# EAGLE design 5V AC-DC Convertor (EAGLE 9.6.2)
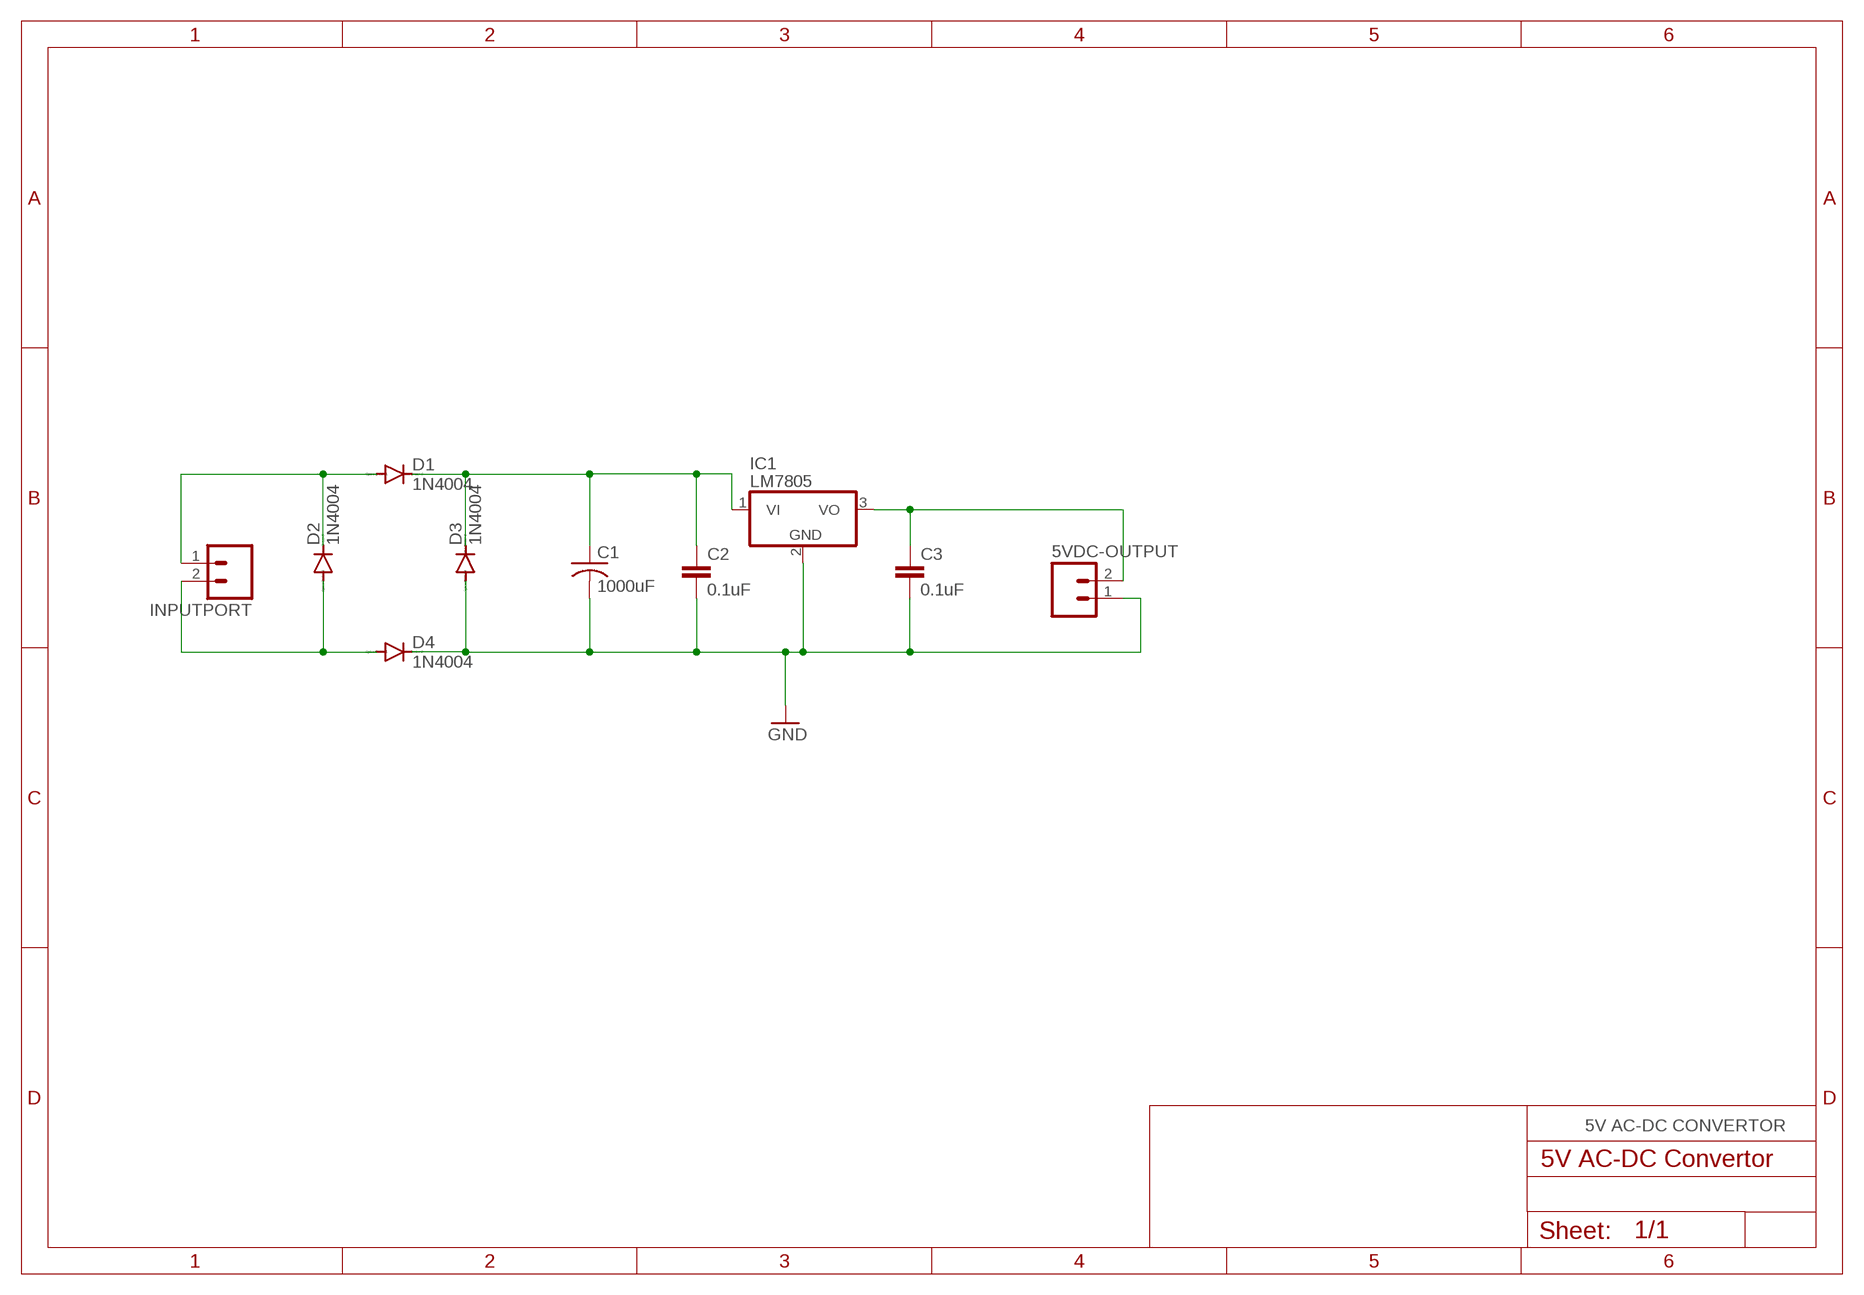
[diagram p0: schematic, sheet 1]

## Parts
5VDC-OUTPUT  M02  [02P]
C1  1000uF  C-US025-024X044  [C025-024X044]
C2  0.1uF  C-EU025-025X050  [C025-025X050]
C3  0.1uF  C-EU025-025X050  [C025-025X050]
D1  1N4004  [DO41-10]
D2  1N4004  [DO41-10]
D3  1N4004  [DO41-10]
D4  1N4004  [DO41-10]
IC1  LM7805  786TV  [TO220V]
INPUTPORT  M02  [02P]

## Nets
GND: 5VDC-OUTPUT.1 C1.2 C2.2 C3.2 D3.A D4.C IC1.2(GND)
N$1: D1.A D2.C INPUTPORT.1
N$2: D2.A D4.A INPUTPORT.2
N$3: C1.1 C2.1 D1.C D3.C IC1.1(VI)
N$8: 5VDC-OUTPUT.2 C3.1 IC1.3(VO)

## Notes on the sheet
- 5V AC-DC CONVERTOR

## Library data of the parts
5VDC-OUTPUT INPUTPORT = con-amp-quick:M02: AMP QUICK CONNECTOR; OC_FARNELL: unknown; OC_NEWARK: unknown
C1 = rcl:C-US: CAPACITOR, American symbol; SPICEPREFIX: C
C2 C3 = rcl:C-EU: CAPACITOR, European symbol; SPICEPREFIX: C
D1-D4 = diode:1N4004: DIODE general purpose rectifier, 1 A
IC1 = linear:78*: Positive VOLTAGE REGULATOR Source: http://cache.national.com/ds/LM/LM78L05.pdf http://www.fairchildsemi.com/ds/LM/LM7805.pdf

## Board
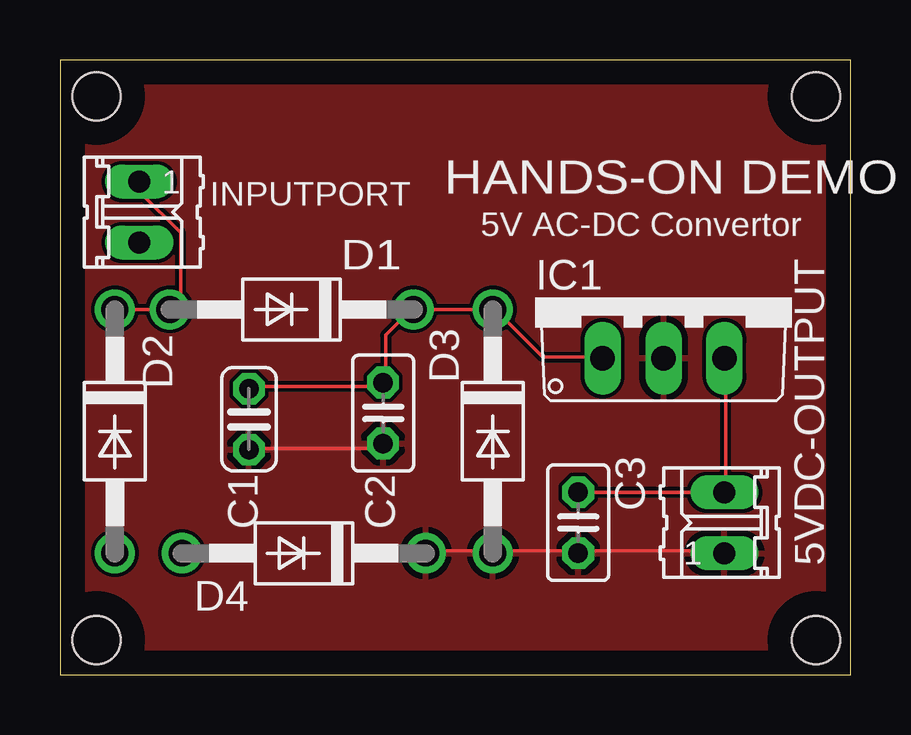
[diagram p1: board, top side]
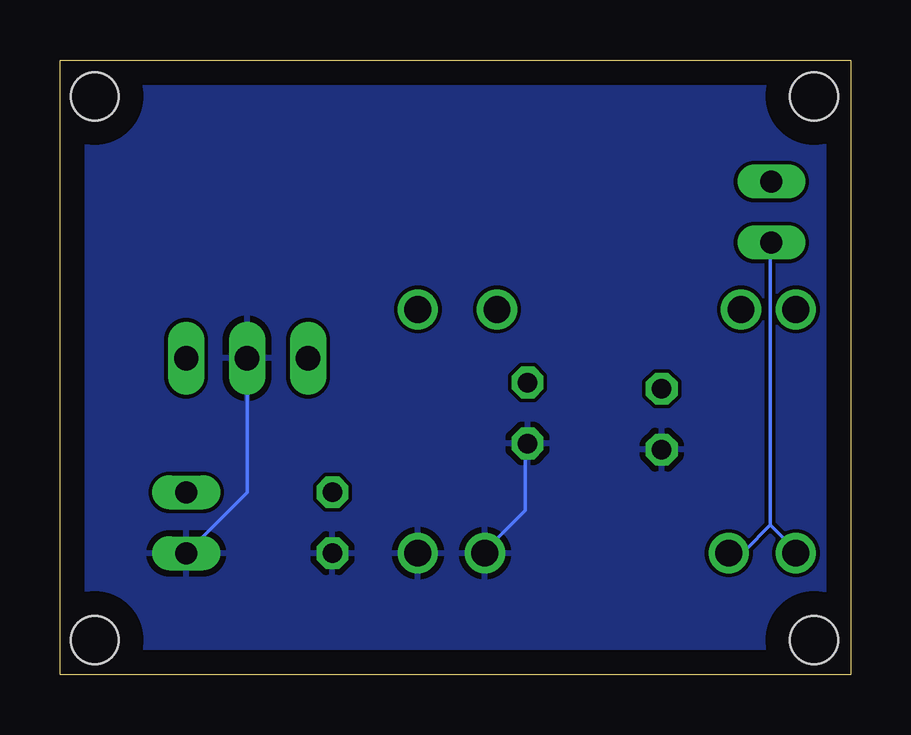
[diagram p2: board, bottom side, seen from below]

Size 32.94 x 25.64 mm. Coordinates in mm from the lower left corner, seen from the top.
Outline: 0,0 32.94,0 32.94,25.64 0,25.64 0,0
Copper layers (1*16): Top 0.035mm / dielectric 1.5mm / Bottom 0.035mm
Design rules "default": minimum track width 6mil, minimum drill 0.35mm, track to track 6mil, track to pad 6mil, pad to pad 6mil, via to via 6mil, smd to smd 6mil, copper to edge 40mil, drill to drill 6mil, minimum pad ring 10mil, minimum via ring 8mil, stop-mask expansion 4mil, vias tented up to drill 0mil, thermal gap 10mil
Holes 2 mm at 1.52,24.13 31.5,24.13 1.52,1.46 31.5,1.46

### Footprints (pad centres in the part's own frame; a part is rotated, then mirrored left to right if it is on the bottom)
02P = drill 0.914 long: 1 -1.27,0; 2 1.27,0
C025-024X044 = drill 0.813 octagon: 1 -1.27,0; 2 1.27,0
C025-025X050 = drill 0.813 octagon: 1 -1.27,0; 2 1.27,0
DO41-10 = drill 1.118: A 5.08,0; C -5.08,0
TO220V = drill 1.016 long: 1 -2.54,-2.54; 2 0,-2.54; 3 2.54,-2.54

### Placement (x,y rotation side)
5VDC-OUTPUT  27.69,6.35 90 top
C1  7.87,10.67 270 top
C2  13.46,10.92 270 top
C3  21.59,6.35 270 top
D1  9.65,15.24 180 top
D2  2.29,10.16 270 top
D3  18.03,10.16 270 top
D4  10.16,5.08 180 top
IC1  25.15,15.75 0 top
INPUTPORT  3.3,19.3 270 top

### Tracks (layer width: path | path; a pad name or v marks a point on that pad's centre or on a via)
GND
  Top 0.152: C2.2 13.26,9.45 7.92,9.45 C1.2 | 5VDC-OUTPUT.1 27.58,5.18 21.64,5.18 C3.2 21.49,5.18 18.14,5.18 D3.A 17.98,5.18 15.24,5.18 D4.C
  Bottom 0.152: IC1.2 25.15,7.62 5VDC-OUTPUT.1 | C2.2 13.56,9.6 13.56,6.86 15.24,5.18 D4.C
  pour Top: -0.51,26.16 33.53,26.16 33.53,-0.76 -0.51,-0.76
  pour Bottom: -1.02,26.92 34.29,26.92 34.29,-1.52 -1.02,-1.52
N$1
  Top 0.152: INPUTPORT.1 3.35,20.57 3.35,20.12 5.03,18.44 5.03,15.7 D1.A D2.C
N$2
  Bottom 0.152: 3.35,6.25 3.35,17.98 INPUTPORT.2 | 3.35,6.25 2.29,5.18 D2.A | 3.35,6.25 4.42,5.18 5.03,5.18 D4.A
N$3
  Top 0.152: C1.1 7.92,12.04 13.26,12.04 13.41,12.19 C2.1 13.56,12.19 13.56,14.17 14.63,15.24 D1.C D3.C 18.14,15.24 20.12,13.26 22.55,13.26 IC1.1
N$8
  Top 0.152: C3.1 5VDC-OUTPUT.2 27.74,7.62 27.74,13.11 IC1.3

### Text on the board
tPlace: HANDS-ON DEMO 1 | 5V AC-DC Convertor